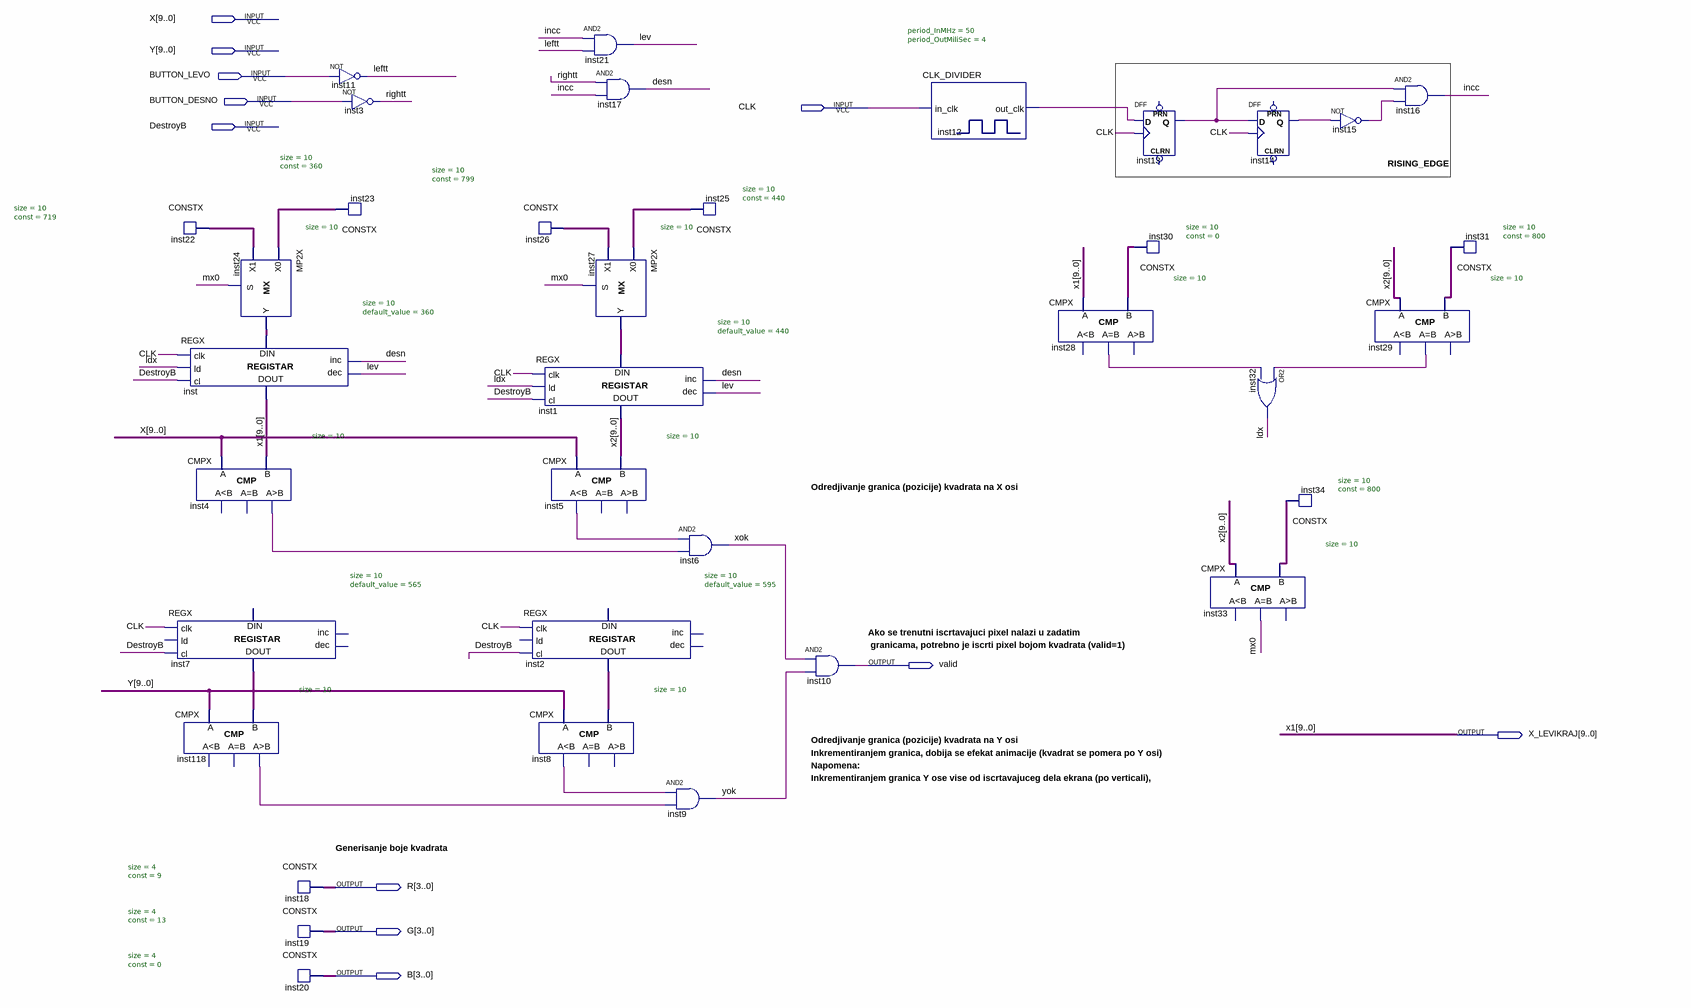
[diagram p0: schematic sheet]
// Quartus schematic Brod.bdf as structural Verilog: 36 symbols, 11 pins
module Brod (
  input  [9:0] X,
  input  [9:0] Y,
  input  BUTTON_LEVO,
  input  BUTTON_DESNO,
  input  CLK,
  input  DestroyB,
  output valid,
  output [9:0] X_LEVIKRAJ,
  output [3:0] R,
  output [3:0] G,
  output [3:0] B
);

  wire desn, incc, inst4_gr, inst5_ls, inst8_ls, inst12_out_clk, inst13_q, inst14_q, inst15_out, inst28_eq,
       inst29_eq, inst118_gr, ldx, leftt, lev, mx0, rightt, xok, yok;
  wire [9:0] inst2_data_out, inst7_data_out, inst22_data, inst23_data, inst24_y, inst25_data, inst26_data,
       inst27_y, inst30_data, inst31_data, inst34_data, x2;

  CONSTX #(.size(10), .\const (719)) inst22 (.data(inst22_data));
  REGX #(.size(10), .default_value(360)) inst (
    .clk(CLK), .ld(ldx), .cl(DestroyB), .inc(desn), .dec(lev), .data_in(inst24_y), .data_out(X_LEVIKRAJ));
  CMPX #(.size(10)) inst4 (.A(X), .B(X_LEVIKRAJ), .gr(inst4_gr));  // open: ls, eq
  REGX #(.size(10), .default_value(565)) inst7 (
    .clk(CLK), .cl(DestroyB), .data_out(inst7_data_out));  // open: ld, inc, dec, data_in
  CMPX #(.size(10)) inst118 (.A(Y), .B(inst7_data_out), .gr(inst118_gr));  // open: ls, eq
  MP2X #(.size(10)) inst24 (.S(mx0), .X0(inst23_data), .X1(inst22_data), .Y(inst24_y));
  CONSTX #(.size(4), .\const (9)) inst18 (.data(R));
  CONSTX #(.size(4), .\const (13)) inst19 (.data(G));
  CONSTX #(.size(4), .\const (0)) inst20 (.data(B));
  not inst11 (leftt, BUTTON_LEVO);
  not inst3 (rightt, BUTTON_DESNO);
  CONSTX #(.size(10), .\const (360)) inst23 (.data(inst23_data));
  CONSTX #(.size(10), .\const (799)) inst26 (.data(inst26_data));
  REGX #(.size(10), .default_value(440)) inst1 (
    .clk(CLK), .ld(ldx), .cl(DestroyB), .inc(desn), .dec(lev), .data_in(inst27_y), .data_out(x2));
  CMPX #(.size(10)) inst5 (.A(X), .B(x2), .ls(inst5_ls));  // open: eq, gr
  REGX #(.size(10), .default_value(595)) inst2 (
    .clk(CLK), .cl(DestroyB), .data_out(inst2_data_out));  // open: ld, inc, dec, data_in
  CMPX #(.size(10)) inst8 (.A(Y), .B(inst2_data_out), .ls(inst8_ls));  // open: eq, gr
  and inst21 (lev, incc, leftt);
  and inst17 (desn, rightt, incc);
  MP2X #(.size(10)) inst27 (.S(mx0), .X0(inst25_data), .X1(inst26_data), .Y(inst27_y));
  and inst9 (yok, inst8_ls, inst118_gr);
  CONSTX #(.size(10), .\const (440)) inst25 (.data(inst25_data));
  and inst6 (xok, inst5_ls, inst4_gr);
  and inst10 (valid, xok, yok);
  CLK_DIVIDER #(.period_InMHz(50), .period_OutMiliSec(4)) inst12 (.in_clk(CLK), .out_clk(inst12_out_clk));
  CMPX #(.size(10)) inst28 (.A(X_LEVIKRAJ), .B(inst30_data), .eq(inst28_eq));  // open: ls, gr
  DFF inst13 (.CLK(CLK), .D(inst12_out_clk), .Q(inst13_q));  // open: CLRN, PRN
  CONSTX #(.size(10), .\const (0)) inst30 (.data(inst30_data));
  CMPX #(.size(10)) inst33 (.A(x2), .B(inst34_data), .eq(mx0));  // open: ls, gr
  DFF inst14 (.CLK(CLK), .D(inst13_q), .Q(inst14_q));  // open: CLRN, PRN
  or inst32 (ldx, inst29_eq, inst28_eq);
  CONSTX #(.size(10), .\const (800)) inst34 (.data(inst34_data));
  not inst15 (inst15_out, inst14_q);
  CMPX #(.size(10)) inst29 (.A(x2), .B(inst31_data), .eq(inst29_eq));  // open: ls, gr
  and inst16 (incc, inst13_q, inst15_out);
  CONSTX #(.size(10), .\const (800)) inst31 (.data(inst31_data));

  // Other names for the same wires on the sheet: x1[9:0] = X_LEVIKRAJ

  // Notes on the sheet:
  //   RISING_EDGE
  //   Odredjivanje granica (pozicije) kvadrata na X osi
  //   Ako se trenutni iscrtavajuci pixel nalazi u zadatim
  //    granicama, potrebno je iscrti pixel bojom kvadrata (valid=1)
  //   Odredjivanje granica (pozicije) kvadrata na Y osi
  //   Inkrementiranjem granica, dobija se efekat animacije (kvadrat se pomera po Y osi)
  //   Napomena:
  //   Inkrementiranjem granica Y ose vise od iscrtavajuceg dela ekrana (po verticali),
  //   Generisanje boje kvadrata
endmodule
